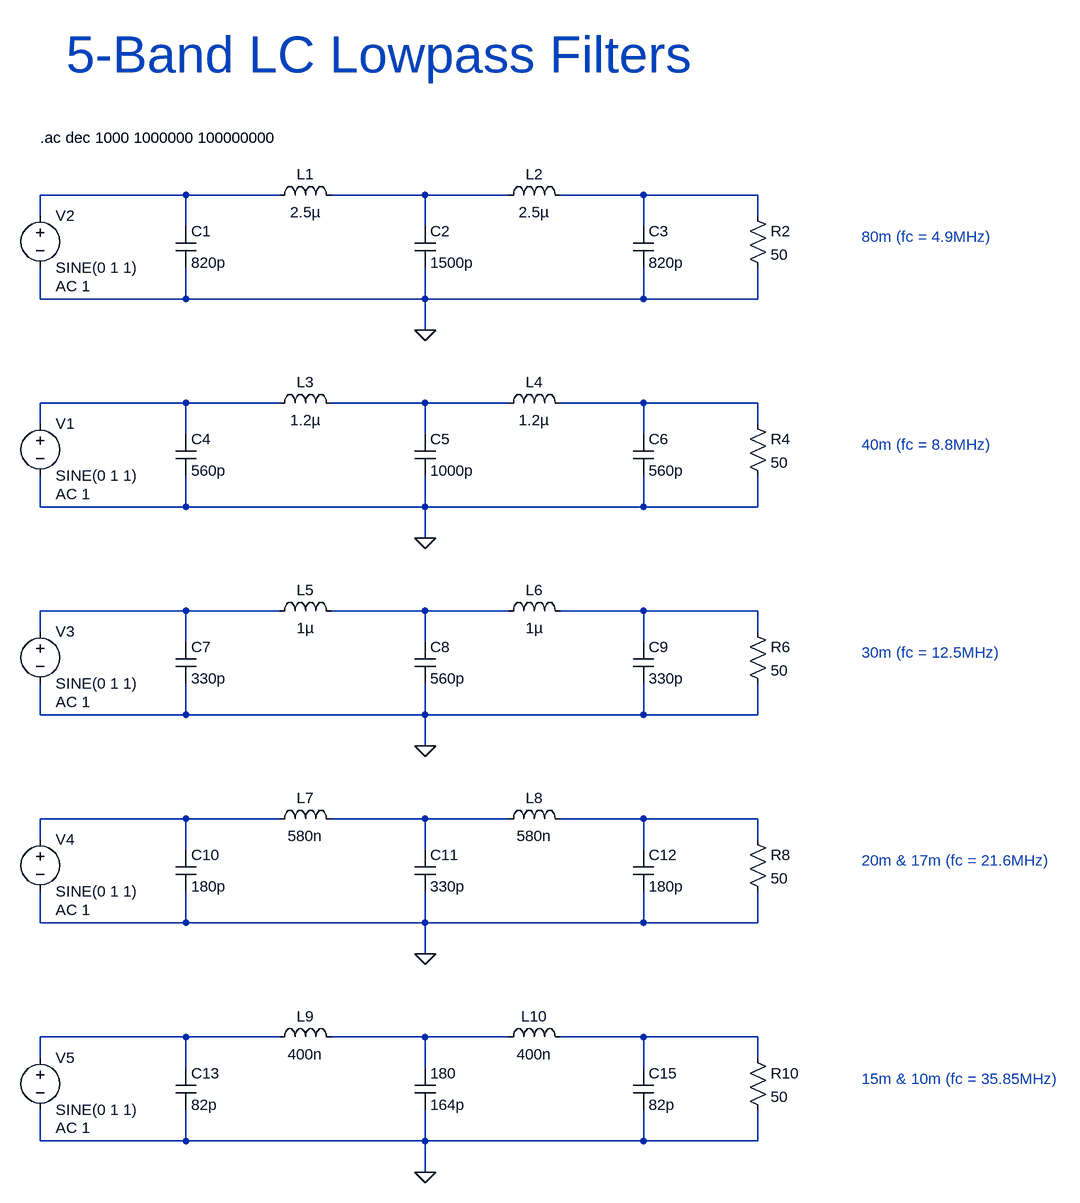
[diagram p0: schematic LC Lowpass Filters.asc]
LC Lowpass Filters.asc, the LTspice schematic file:
Version 4
SHEET 1 3132 1988
WIRE 240 464 16 464
WIRE 384 464 240 464
WIRE 608 464 464 464
WIRE 736 464 608 464
WIRE 944 464 816 464
WIRE 1120 464 944 464
WIRE 16 496 16 464
WIRE 1120 496 1120 464
WIRE 240 512 240 464
WIRE 608 512 608 464
WIRE 944 512 944 464
WIRE 16 624 16 576
WIRE 240 624 240 576
WIRE 240 624 16 624
WIRE 608 624 608 576
WIRE 608 624 240 624
WIRE 944 624 944 576
WIRE 944 624 608 624
WIRE 1120 624 1120 576
WIRE 1120 624 944 624
WIRE 608 672 608 624
WIRE 240 784 16 784
WIRE 384 784 240 784
WIRE 608 784 464 784
WIRE 736 784 608 784
WIRE 944 784 816 784
WIRE 1120 784 944 784
WIRE 16 816 16 784
WIRE 1120 816 1120 784
WIRE 240 832 240 784
WIRE 608 832 608 784
WIRE 944 832 944 784
WIRE 16 944 16 896
WIRE 240 944 240 896
WIRE 240 944 16 944
WIRE 608 944 608 896
WIRE 608 944 240 944
WIRE 944 944 944 896
WIRE 944 944 608 944
WIRE 1120 944 1120 896
WIRE 1120 944 944 944
WIRE 608 992 608 944
WIRE 240 1104 16 1104
WIRE 384 1104 240 1104
WIRE 608 1104 464 1104
WIRE 736 1104 608 1104
WIRE 944 1104 816 1104
WIRE 1120 1104 944 1104
WIRE 16 1136 16 1104
WIRE 1120 1136 1120 1104
WIRE 240 1152 240 1104
WIRE 608 1152 608 1104
WIRE 944 1152 944 1104
WIRE 16 1264 16 1216
WIRE 240 1264 240 1216
WIRE 240 1264 16 1264
WIRE 608 1264 608 1216
WIRE 608 1264 240 1264
WIRE 944 1264 944 1216
WIRE 944 1264 608 1264
WIRE 1120 1264 1120 1216
WIRE 1120 1264 944 1264
WIRE 608 1312 608 1264
WIRE 240 1424 16 1424
WIRE 384 1424 240 1424
WIRE 608 1424 464 1424
WIRE 736 1424 608 1424
WIRE 944 1424 816 1424
WIRE 1120 1424 944 1424
WIRE 16 1456 16 1424
WIRE 1120 1456 1120 1424
WIRE 240 1472 240 1424
WIRE 608 1472 608 1424
WIRE 944 1472 944 1424
WIRE 16 1584 16 1536
WIRE 240 1584 240 1536
WIRE 240 1584 16 1584
WIRE 608 1584 608 1536
WIRE 608 1584 240 1584
WIRE 944 1584 944 1536
WIRE 944 1584 608 1584
WIRE 1120 1584 1120 1536
WIRE 1120 1584 944 1584
WIRE 608 1632 608 1584
WIRE 240 1760 16 1760
WIRE 384 1760 240 1760
WIRE 608 1760 464 1760
WIRE 736 1760 608 1760
WIRE 944 1760 816 1760
WIRE 1120 1760 944 1760
WIRE 16 1792 16 1760
WIRE 1120 1792 1120 1760
WIRE 240 1808 240 1760
WIRE 608 1808 608 1760
WIRE 944 1808 944 1760
WIRE 16 1920 16 1872
WIRE 240 1920 240 1872
WIRE 240 1920 16 1920
WIRE 608 1920 608 1872
WIRE 608 1920 240 1920
WIRE 944 1920 944 1872
WIRE 944 1920 608 1920
WIRE 1120 1920 1120 1872
WIRE 1120 1920 944 1920
WIRE 608 1968 608 1920
FLAG 608 672 0
FLAG 608 992 0
FLAG 608 1312 0
FLAG 608 1632 0
FLAG 608 1968 0
SYMBOL res 1104 480 R0
SYMATTR InstName R2
SYMATTR Value 50
SYMBOL voltage 16 480 R0
WINDOW 123 24 124 Left 2
WINDOW 39 0 0 Left 2
SYMATTR Value2 AC 1
SYMATTR InstName V2
SYMATTR Value SINE(0 1 1)
SYMBOL cap 224 512 R0
SYMATTR InstName C1
SYMATTR Value 820p
SYMBOL cap 592 512 R0
SYMATTR InstName C2
SYMATTR Value 1500p
SYMBOL cap 928 512 R0
SYMATTR InstName C3
SYMATTR Value 820p
SYMBOL ind 368 480 R270
WINDOW 0 32 56 VTop 2
WINDOW 3 5 56 VBottom 2
SYMATTR InstName L1
SYMATTR Value 2.5µ
SYMBOL ind 720 480 R270
WINDOW 0 32 56 VTop 2
WINDOW 3 5 56 VBottom 2
SYMATTR InstName L2
SYMATTR Value 2.5µ
SYMBOL res 1104 800 R0
SYMATTR InstName R4
SYMATTR Value 50
SYMBOL voltage 16 800 R0
WINDOW 123 24 124 Left 2
WINDOW 39 0 0 Left 2
SYMATTR Value2 AC 1
SYMATTR InstName V1
SYMATTR Value SINE(0 1 1)
SYMBOL cap 224 832 R0
SYMATTR InstName C4
SYMATTR Value 560p
SYMBOL cap 592 832 R0
SYMATTR InstName C5
SYMATTR Value 1000p
SYMBOL cap 928 832 R0
SYMATTR InstName C6
SYMATTR Value 560p
SYMBOL ind 368 800 R270
WINDOW 0 32 56 VTop 2
WINDOW 3 5 56 VBottom 2
SYMATTR InstName L3
SYMATTR Value 1.2µ
SYMBOL ind 720 800 R270
WINDOW 0 32 56 VTop 2
WINDOW 3 5 56 VBottom 2
SYMATTR InstName L4
SYMATTR Value 1.2µ
SYMBOL res 1104 1120 R0
SYMATTR InstName R6
SYMATTR Value 50
SYMBOL voltage 16 1120 R0
WINDOW 123 24 124 Left 2
WINDOW 39 0 0 Left 2
SYMATTR Value2 AC 1
SYMATTR InstName V3
SYMATTR Value SINE(0 1 1)
SYMBOL cap 224 1152 R0
SYMATTR InstName C7
SYMATTR Value 330p
SYMBOL cap 592 1152 R0
SYMATTR InstName C8
SYMATTR Value 560p
SYMBOL cap 928 1152 R0
SYMATTR InstName C9
SYMATTR Value 330p
SYMBOL ind 368 1120 R270
WINDOW 0 32 56 VTop 2
WINDOW 3 5 56 VBottom 2
SYMATTR InstName L5
SYMATTR Value 1µ
SYMBOL ind 720 1120 R270
WINDOW 0 32 56 VTop 2
WINDOW 3 5 56 VBottom 2
SYMATTR InstName L6
SYMATTR Value 1µ
SYMBOL res 1104 1440 R0
SYMATTR InstName R8
SYMATTR Value 50
SYMBOL voltage 16 1440 R0
WINDOW 123 24 124 Left 2
WINDOW 39 0 0 Left 2
SYMATTR Value2 AC 1
SYMATTR InstName V4
SYMATTR Value SINE(0 1 1)
SYMBOL cap 224 1472 R0
SYMATTR InstName C10
SYMATTR Value 180p
SYMBOL cap 592 1472 R0
SYMATTR InstName C11
SYMATTR Value 330p
SYMBOL cap 928 1472 R0
SYMATTR InstName C12
SYMATTR Value 180p
SYMBOL ind 368 1440 R270
WINDOW 0 32 56 VTop 2
WINDOW 3 5 56 VBottom 2
SYMATTR InstName L7
SYMATTR Value 580n
SYMBOL ind 720 1440 R270
WINDOW 0 32 56 VTop 2
WINDOW 3 5 56 VBottom 2
SYMATTR InstName L8
SYMATTR Value 580n
SYMBOL res 1104 1776 R0
SYMATTR InstName R10
SYMATTR Value 50
SYMBOL voltage 16 1776 R0
WINDOW 123 24 124 Left 2
WINDOW 39 0 0 Left 2
SYMATTR Value2 AC 1
SYMATTR InstName V5
SYMATTR Value SINE(0 1 1)
SYMBOL cap 224 1808 R0
SYMATTR InstName C13
SYMATTR Value 82p
SYMBOL cap 592 1808 R0
SYMATTR InstName 180
SYMATTR Value 164p
SYMBOL cap 928 1808 R0
SYMATTR InstName C15
SYMATTR Value 82p
SYMBOL ind 368 1776 R270
WINDOW 0 32 56 VTop 2
WINDOW 3 5 56 VBottom 2
SYMATTR InstName L9
SYMATTR Value 400n
SYMBOL ind 720 1776 R270
WINDOW 0 32 56 VTop 2
WINDOW 3 5 56 VBottom 2
SYMATTR InstName L10
SYMATTR Value 400n
TEXT 16 376 Left 2 !.ac dec 1000 1000000 100000000
TEXT 1280 528 Left 2 ;80m (fc = 4.9MHz)
TEXT 1280 848 Left 2 ;40m (fc = 8.8MHz)
TEXT 1280 1168 Left 2 ;30m (fc = 12.5MHz)
TEXT 1280 1488 Left 2 ;20m & 17m (fc = 21.6MHz)
TEXT 1280 1824 Left 2 ;15m & 10m (fc = 35.85MHz)
TEXT 56 248 Left 6 ;5-Band LC Lowpass Filters

The netlist it stands for:
* LC Lowpass Filters.asc
R2 N003 0 50
V2 N001 0 SINE(0 1 1) AC 1
C1 N001 0 820p
C2 N002 0 1500p
C3 N003 0 820p
L1 N001 N002 2.5µ
L2 N002 N003 2.5µ
R4 N006 0 50
V1 N004 0 SINE(0 1 1) AC 1
C4 N004 0 560p
C5 N005 0 1000p
C6 N006 0 560p
L3 N004 N005 1.2µ
L4 N005 N006 1.2µ
R6 N009 0 50
V3 N007 0 SINE(0 1 1) AC 1
C7 N007 0 330p
C8 N008 0 560p
C9 N009 0 330p
L5 N007 N008 1µ
L6 N008 N009 1µ
R8 N012 0 50
V4 N010 0 SINE(0 1 1) AC 1
C10 N010 0 180p
C11 N011 0 330p
C12 N012 0 180p
L7 N010 N011 580n
L8 N011 N012 580n
R10 N015 0 50
V5 N013 0 SINE(0 1 1) AC 1
C13 N013 0 82p
C§180 N014 0 164p
C15 N015 0 82p
L9 N013 N014 400n
L10 N014 N015 400n
.ac dec 1000 1000000 100000000
* 80m (fc = 4.9MHz)
* 40m (fc = 8.8MHz)
* 30m (fc = 12.5MHz)
* 20m & 17m (fc = 21.6MHz)
* 15m & 10m (fc = 35.85MHz)
* 5-Band LC Lowpass Filters
.backanno
.end